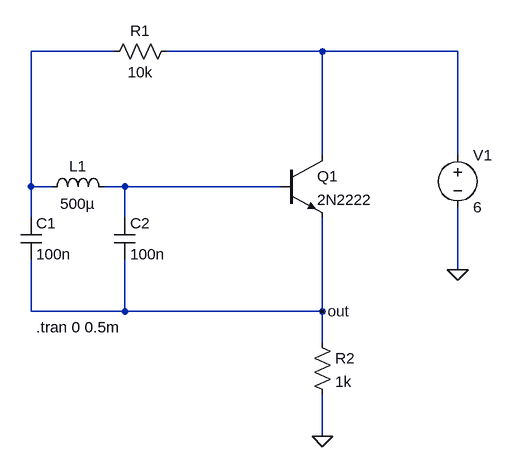
[diagram p0: schematic Colpiitts_Oscillator.asc]
Colpiitts_Oscillator.asc, the LTspice schematic file:
Version 4.1
SHEET 1 880 680
WIRE 64 -128 -64 -128
WIRE 384 -128 144 -128
WIRE 592 -128 384 -128
WIRE 384 32 384 -128
WIRE 592 32 592 -128
WIRE -64 80 -64 -128
WIRE -32 80 -64 80
WIRE 80 80 48 80
WIRE 320 80 80 80
WIRE -64 128 -64 80
WIRE 80 128 80 80
WIRE 592 208 592 112
WIRE -64 272 -64 192
WIRE 80 272 80 192
WIRE 80 272 -64 272
WIRE 384 272 384 128
WIRE 384 272 80 272
WIRE 384 320 384 272
WIRE 384 464 384 400
FLAG 384 464 0
FLAG 592 208 0
FLAG 384 272 out
SYMBOL cap -80 128 R0
SYMATTR InstName C1
SYMATTR Value 100n
SYMBOL cap 64 128 R0
SYMATTR InstName C2
SYMATTR Value 100n
SYMBOL ind -48 96 R270
WINDOW 0 32 56 VTop 2
WINDOW 3 5 56 VBottom 2
SYMATTR InstName L1
SYMATTR Value 500µ
SYMATTR SpiceLine Rser=500u
SYMBOL npn 320 32 R0
SYMATTR InstName Q1
SYMATTR Value 2N2222
SYMBOL res 160 -144 R90
WINDOW 0 0 56 VBottom 2
WINDOW 3 32 56 VTop 2
SYMATTR InstName R1
SYMATTR Value 10k
SYMBOL res 368 304 R0
SYMATTR InstName R2
SYMATTR Value 1k
SYMBOL voltage 592 16 R0
SYMATTR InstName V1
SYMATTR Value 6
TEXT -56 296 Left 2 !.tran 0 0.5m

The netlist it stands for:
* Colpiitts_Oscillator.asc
C1 N001 out 100n
C2 N003 out 100n
L1 N001 N003 500µ Rser=500u
Q1 N002 N003 out 0 2N2222
R1 N002 N001 10k
R2 out 0 1k
V1 N002 0 6
.model NPN NPN
.model PNP PNP
.lib standard.bjt
.tran 0 0.5m
.backanno
.end